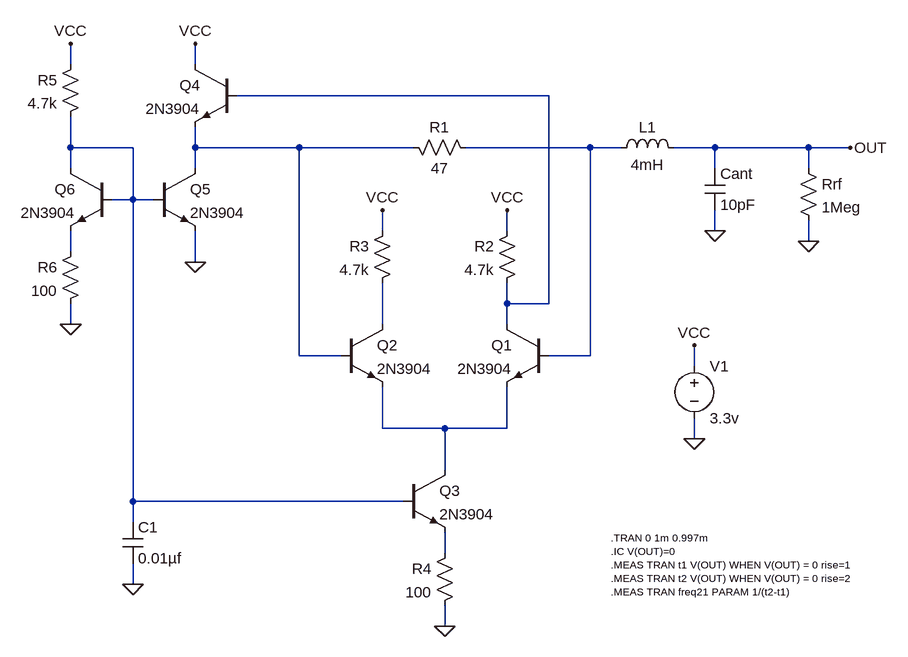
[diagram p0: schematic diff_osc_2020-11-15.asc]
diff_osc_2020-11-15.asc, the LTspice schematic file:
Version 4
SHEET 1 2908 996
WIRE -240 -80 -240 -112
WIRE -48 -80 -48 -112
WIRE 496 -32 16 -32
WIRE -240 48 -240 0
WIRE -144 48 -240 48
WIRE -48 48 -48 16
WIRE 112 48 -48 48
WIRE 288 48 112 48
WIRE 560 48 368 48
WIRE 608 48 560 48
WIRE 752 48 688 48
WIRE 896 48 752 48
WIRE 960 48 896 48
WIRE -240 80 -240 48
WIRE -48 80 -48 48
WIRE 752 80 752 48
WIRE 896 80 896 48
WIRE -144 128 -144 48
WIRE -144 128 -176 128
WIRE -112 128 -144 128
WIRE 240 176 240 144
WIRE 432 176 432 144
WIRE 752 176 752 144
WIRE 896 192 896 160
WIRE -240 208 -240 176
WIRE -48 224 -48 176
WIRE 432 288 432 256
WIRE 496 288 496 -32
WIRE 496 288 432 288
WIRE -240 320 -240 288
WIRE 240 320 240 256
WIRE 432 320 432 288
WIRE 112 368 112 48
WIRE 176 368 112 368
WIRE 560 368 560 48
WIRE 560 368 496 368
WIRE 720 384 720 352
WIRE 240 480 240 416
WIRE 336 480 240 480
WIRE 432 480 432 416
WIRE 432 480 336 480
WIRE 720 496 720 464
WIRE 336 544 336 480
WIRE -144 592 -144 128
WIRE 272 592 -144 592
WIRE -144 624 -144 592
WIRE 336 672 336 640
WIRE -144 720 -144 688
WIRE 336 784 336 752
FLAG 720 496 0
FLAG 720 352 VCC
FLAG 960 48 OUT
FLAG 752 176 0
FLAG 896 192 0
FLAG -48 224 0
FLAG -240 -112 VCC
FLAG -240 320 0
FLAG 336 784 0
FLAG -144 720 0
FLAG -48 -112 VCC
FLAG 240 144 VCC
FLAG 432 144 VCC
SYMBOL res 384 64 M270
WINDOW 0 32 56 VTop 2
WINDOW 3 0 56 VBottom 2
SYMATTR InstName R1
SYMATTR Value 47
SYMBOL voltage 720 368 R0
WINDOW 123 0 0 Left 2
WINDOW 39 0 0 Left 2
SYMATTR InstName V1
SYMATTR Value 3.3v
SYMBOL npn 176 320 R0
SYMATTR InstName Q2
SYMATTR Value 2N3904
SYMBOL ind 592 64 R270
WINDOW 0 32 56 VTop 2
WINDOW 3 5 56 VBottom 2
SYMATTR InstName L1
SYMATTR Value 4mH
SYMBOL cap 736 80 R0
SYMATTR InstName Cant
SYMATTR Value 10pF
SYMBOL npn 496 320 M0
SYMATTR InstName Q1
SYMATTR Value 2N3904
SYMBOL npn 16 -80 M0
SYMATTR InstName Q4
SYMATTR Value 2N3904
SYMBOL res 448 160 M0
SYMATTR InstName R2
SYMATTR Value 4.7k
SYMBOL res 256 160 M0
SYMATTR InstName R3
SYMATTR Value 4.7k
SYMBOL res 880 64 R0
SYMATTR InstName Rrf
SYMATTR Value 1Meg
SYMBOL res -224 -96 M0
SYMATTR InstName R5
SYMATTR Value 4.7k
SYMBOL npn -112 80 R0
SYMATTR InstName Q5
SYMATTR Value 2N3904
SYMBOL npn -176 80 M0
SYMATTR InstName Q6
SYMATTR Value 2N3904
SYMBOL res -224 192 M0
SYMATTR InstName R6
SYMATTR Value 100
SYMBOL npn 272 544 R0
SYMATTR InstName Q3
SYMATTR Value 2N3904
SYMBOL res 352 656 M0
SYMATTR InstName R4
SYMATTR Value 100
SYMBOL cap -160 624 R0
SYMATTR InstName C1
SYMATTR Value 0.01µf
TEXT 592 648 Left 1 !.TRAN 0 1m 0.997m\n.IC V(OUT)=0\n.MEAS TRAN t1 V(OUT) WHEN V(OUT) = 0 rise=1\n.MEAS TRAN t2 V(OUT) WHEN V(OUT) = 0 rise=2\n.MEAS TRAN freq21 PARAM 1/(t2-t1)

The netlist it stands for:
* diff_osc_2020-11-15.asc
R1 N004 N003 47
V1 VCC 0 3.3v
Q2 N006 N003 N007 0 2N3904
L1 N004 OUT 4mH
Cant OUT 0 10pF
Q1 N001 N004 N007 0 2N3904
Q4 VCC N001 N003 0 2N3904
R2 VCC N001 4.7k
R3 VCC N006 4.7k
Rrf OUT 0 1Meg
R5 VCC N002 4.7k
Q5 N003 N002 0 0 2N3904
Q6 N002 N002 N005 0 2N3904
R6 N005 0 100
Q3 N007 N002 N008 0 2N3904
R4 N008 0 100
C1 N002 0 0.01µf
.model NPN NPN
.model PNP PNP
.lib standard.bjt
.TRAN 0 1m 0.997m
.IC V(OUT)=0
.MEAS TRAN t1 V(OUT) WHEN V(OUT) = 0 rise=1
.MEAS TRAN t2 V(OUT) WHEN V(OUT) = 0 rise=2
.MEAS TRAN freq21 PARAM 1/(t2-t1)
.backanno
.end